# Altium schematic sheet EPF10K50RC240-3.SchDoc
size A3
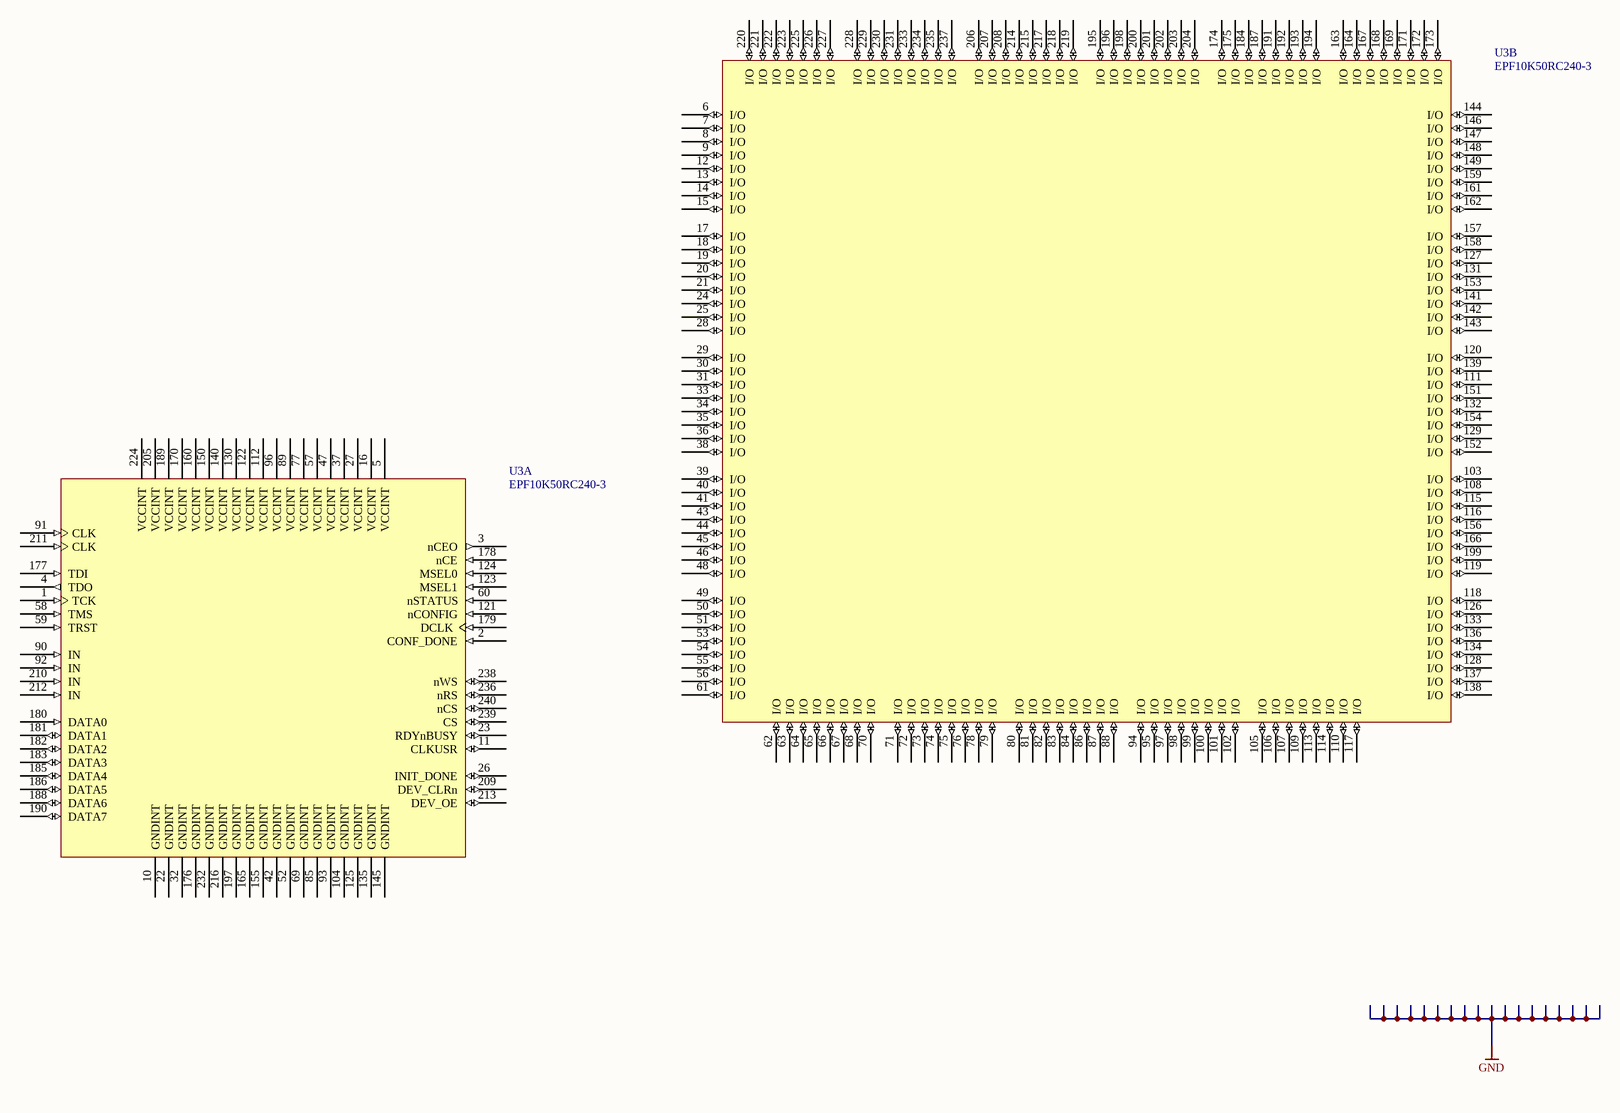
[diagram p0: EPF10K50RC240-3.SchDoc]

## Parts
U3  EPF10K50RC240-3  [RQFP240_N]  (parts A,B of 2)

## Nets

Not connected (* = marked no-connect by the designer): U3 1(TCK) 2(CONF_DONE) 3(nCEO) 4(TDO) 5(VCCINT) 6(I/O) 7(I/O) 8(I/O) 9(I/O) 10(GNDINT) 11(CLKUSR) 12(I/O) 13(I/O) 14(I/O) 15(I/O) 16(VCCINT) 17(I/O) 18(I/O) 19(I/O) 20(I/O) 21(I/O) 22(GNDINT) 23(RDYnBUSY) 24(I/O) 25(I/O) 26(INIT_DONE) 27(VCCINT) 28(I/O) 29(I/O) 30(I/O) 31(I/O) 32(GNDINT) 33(I/O) 34(I/O) 35(I/O) 36(I/O) 37(VCCINT) 38(I/O) 39(I/O) 40(I/O) 41(I/O) 42(GNDINT) 43(I/O) 44(I/O) 45(I/O) 46(I/O) 47(VCCINT) 48(I/O) 49(I/O) 50(I/O) 51(I/O) 52(GNDINT) 53(I/O) 54(I/O) 55(I/O) 56(I/O) 57(VCCINT) 58(TMS) 59(TRST) 60(nSTATUS) 61(I/O) 62(I/O) 63(I/O) 64(I/O) 65(I/O) 66(I/O) 67(I/O) 68(I/O) 69(GNDINT) 70(I/O) 71(I/O) 72(I/O) 73(I/O) 74(I/O) 75(I/O) 76(I/O) 77(VCCINT) 78(I/O) 79(I/O) 80(I/O) 81(I/O) 82(I/O) 83(I/O) 84(I/O) 85(GNDINT) 86(I/O) 87(I/O) 88(I/O) 89(VCCINT) 90(IN) 91(CLK) 92(IN) 93(GNDINT) 94(I/O) 95(I/O) 96(VCCINT) 97(I/O) 98(I/O) 99(I/O) 100(I/O) 101(I/O) 102(I/O) 103(I/O) 104(GNDINT) 105(I/O) 106(I/O) 107(I/O) 108(I/O) 109(I/O) 110(I/O) 111(I/O) 112(VCCINT) 113(I/O) 114(I/O) 115(I/O) 116(I/O) 117(I/O) 118(I/O) 119(I/O) 120(I/O) 121(nCONFIG) 122(VCCINT) 123(MSEL1) 124(MSEL0) 125(GNDINT) 126(I/O) 127(I/O) 128(I/O) 129(I/O) 130(VCCINT) 131(I/O) 132(I/O) 133(I/O) 134(I/O) 135(GNDINT) 136(I/O) 137(I/O) 138(I/O) 139(I/O) 140(VCCINT) 141(I/O) 142(I/O) 143(I/O) 144(I/O) 145(GNDINT) 146(I/O) 147(I/O) 148(I/O) 149(I/O) 150(VCCINT) 151(I/O) 152(I/O) 153(I/O) 154(I/O) 155(GNDINT) 156(I/O) 157(I/O) 158(I/O) 159(I/O) 160(VCCINT) 161(I/O) 162(I/O) 163(I/O) 164(I/O) 165(GNDINT) 166(I/O) 167(I/O) 168(I/O) 169(I/O) 170(VCCINT) 171(I/O) 172(I/O) 173(I/O) 174(I/O) 175(I/O) 176(GNDINT) 177(TDI) 178(nCE) 179(DCLK) 180(DATA0) 181(DATA1) 182(DATA2) 183(DATA3) 184(I/O) 185(DATA4) 186(DATA5) 187(I/O) 188(DATA6) 189(VCCINT) 190(DATA7) 191(I/O) 192(I/O) 193(I/O) 194(I/O) 195(I/O) 196(I/O) 197(GNDINT) 198(I/O) 199(I/O) 200(I/O) 201(I/O) 202(I/O) 203(I/O) 204(I/O) 205(VCCINT) 206(I/O) 207(I/O) 208(I/O) 209(DEV_CLRn) 210(IN) 211(CLK) 212(IN) 213(DEV_OE) 214(I/O) 215(I/O) 216(GNDINT) 217(I/O) 218(I/O) 219(I/O) 220(I/O) 221(I/O) 222(I/O) 223(I/O) 224(VCCINT) 225(I/O) 226(I/O) 227(I/O) 228(I/O) 229(I/O) 230(I/O) 231(I/O) 232(GNDINT) 233(I/O) 234(I/O) 235(I/O) 236(nRS) 237(I/O) 238(nWS) 239(CS) 240(nCS)

## Library data of the parts
U3 = EPF10K50RC240-3: Published: 24-Nov-2000; LatestRevisionDate: 13-Apr-2006; LatestRevisionNote: IPC-7351 Footprint Added.; DatasheetVersion: ver4.2, Jan-2003; PackageVersion: ver14.2, Oct-2005; PackageReference: RQFP240; Publisher: Altium Limited; PackageDescription: 240-Pin Power Quad Flat Pack (RQFP240); Supplier 1: Digi-Key; Supplier Part Number 1: 544-2238-ND; Code_JEDEC: MS-029-GA; ComponentLink1Description: Manufacturer Link; ComponentLink1URL: http://www.altera.com/products/devices/flex10k/f10-index.html; ComponentLink2Description: Datasheet; ComponentLink2URL: http://www.altera.com/literature/ds/dsf10k.pdf; Part Number: EPF10K50RC240-3